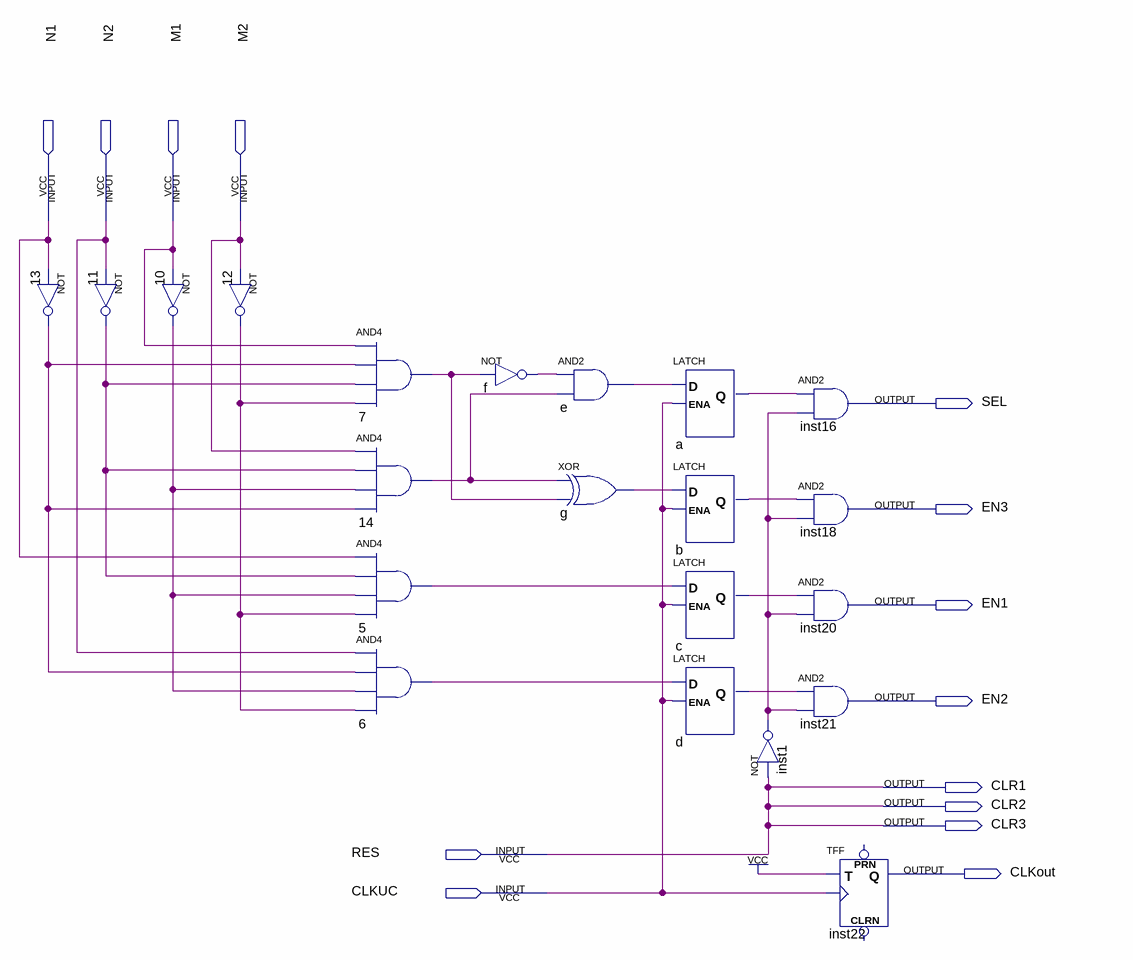
[diagram p0: schematic sheet]
// Quartus schematic UnidadedeControle.bdf as structural Verilog: 21 symbols, 14 pins
module UnidadedeControle (
  input  N1,
  input  N2,
  input  M1,
  input  M2,
  input  RES,
  input  CLKUC,
  output SEL,
  output EN3,
  output EN1,
  output EN2,
  output CLR1,
  output CLR2,
  output CLR3,
  output CLKout
);

  wire a_q, b_q, c_q, d_q, e_out, f_out, g_out, inst1_out, n5_out, n6_out, n7_out, n10_out, n11_out, n12_out,
       n13_out, n14_out;

  not u_13 (n13_out, N1);
  not u_10 (n10_out, M1);
  not u_11 (n11_out, N2);
  not u_12 (n12_out, M2);
  and u_7 (n7_out, M1, n13_out, n11_out, n12_out);
  and u_14 (n14_out, M2, n11_out, n10_out, n13_out);
  and u_5 (n5_out, N1, n11_out, n10_out, n12_out);
  and u_6 (n6_out, N2, n13_out, n10_out, n12_out);
  not f (f_out, n7_out);
  and e (e_out, f_out, n14_out);
  xor g (g_out, n14_out, n7_out);
  LATCH a (.D(e_out), .ENA(CLKUC), .Q(a_q));
  LATCH b (.D(g_out), .ENA(CLKUC), .Q(b_q));
  LATCH c (.D(n5_out), .ENA(CLKUC), .Q(c_q));
  LATCH d (.D(n6_out), .ENA(CLKUC), .Q(d_q));
  not inst1 (inst1_out, RES);
  and inst16 (SEL, a_q, inst1_out);
  and inst18 (EN3, b_q, inst1_out);
  and inst20 (EN1, c_q, inst1_out);
  and inst21 (EN2, d_q, inst1_out);
  TFF inst22 (.T(1'b1), .CLK(CLKUC), .Q(CLKout));  // open: PRN, CLRN

  assign CLR1 = RES;
  assign CLR2 = RES;
  assign CLR3 = RES;
endmodule
